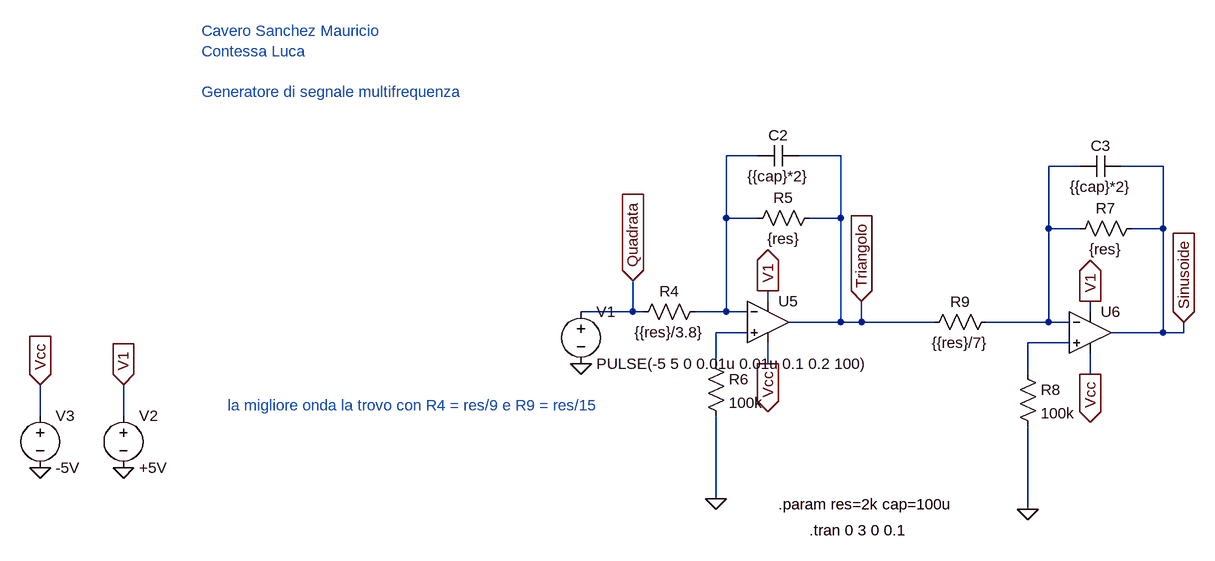
[diagram p0: schematic Progetto_PSE_ideale_v2.asc]
Progetto_PSE_ideale_v2.asc, the LTspice schematic file:
Version 4
SHEET 1 1248 680
WIRE 352 -144 304 -144
WIRE 480 -144 416 -144
WIRE 848 -128 800 -128
WIRE 976 -128 912 -128
WIRE 304 -48 304 -144
WIRE 352 -48 304 -48
WIRE 480 -48 480 -144
WIRE 480 -48 432 -48
WIRE 800 -32 800 -128
WIRE 848 -32 800 -32
WIRE 976 -32 976 -128
WIRE 976 -32 928 -32
WIRE 368 80 368 64
WIRE 160 96 160 48
WIRE 160 96 80 96
WIRE 176 96 160 96
WIRE 304 96 304 -48
WIRE 304 96 256 96
WIRE 336 96 304 96
WIRE 864 96 864 80
WIRE 480 112 480 -48
WIRE 480 112 400 112
WIRE 512 112 512 80
WIRE 512 112 480 112
WIRE 624 112 512 112
WIRE 800 112 800 -32
WIRE 800 112 704 112
WIRE 832 112 800 112
WIRE 336 128 288 128
WIRE 976 128 976 -32
WIRE 976 128 896 128
WIRE 1008 128 1008 112
WIRE 1008 128 976 128
WIRE 832 144 768 144
WIRE 288 176 288 128
WIRE 368 176 368 144
WIRE 768 192 768 144
WIRE 864 192 864 160
WIRE -752 256 -752 208
WIRE -624 256 -624 208
WIRE 288 384 288 256
WIRE 768 400 768 272
FLAG 288 384 0
FLAG 368 64 V1
IOPIN 368 64 Out
FLAG 368 176 Vcc
IOPIN 368 176 Out
FLAG 512 80 Triangolo
IOPIN 512 80 In
FLAG 160 48 Quadrata
IOPIN 160 48 In
FLAG 768 400 0
FLAG 864 80 V1
IOPIN 864 80 Out
FLAG 864 192 Vcc
IOPIN 864 192 Out
FLAG 1008 112 Sinusoide
IOPIN 1008 112 In
FLAG -624 336 0
FLAG -624 208 V1
IOPIN -624 208 In
FLAG -752 336 0
FLAG -752 208 Vcc
IOPIN -752 208 In
FLAG 80 176 0
SYMBOL res 272 80 R90
WINDOW 0 0 56 VBottom 2
WINDOW 3 32 56 VTop 2
SYMATTR InstName R4
SYMATTR Value {{res}/3.8}
SYMBOL res 448 -64 R90
WINDOW 0 0 56 VBottom 2
WINDOW 3 32 56 VTop 2
SYMATTR InstName R5
SYMATTR Value {res}
SYMBOL cap 416 -160 R90
WINDOW 0 0 32 VBottom 2
WINDOW 3 32 32 VTop 2
SYMATTR InstName C2
SYMATTR Value {{cap}*2}
SYMBOL res 272 160 R0
SYMATTR InstName R6
SYMATTR Value 100k
SYMBOL res 944 -48 R90
WINDOW 0 0 56 VBottom 2
WINDOW 3 32 56 VTop 2
SYMATTR InstName R7
SYMATTR Value {res}
SYMBOL cap 912 -144 R90
WINDOW 0 0 32 VBottom 2
WINDOW 3 32 32 VTop 2
SYMATTR InstName C3
SYMATTR Value {{cap}*2}
SYMBOL res 752 176 R0
SYMATTR InstName R8
SYMATTR Value 100k
SYMBOL res 720 96 R90
WINDOW 0 0 56 VBottom 2
WINDOW 3 32 56 VTop 2
SYMATTR InstName R9
SYMATTR Value {{res}/7}
SYMBOL Opamps\\UniversalOpamp2 368 112 R0
SYMATTR InstName U5
SYMBOL Opamps\\UniversalOpamp2 864 128 R0
SYMATTR InstName U6
SYMBOL voltage -624 240 R0
WINDOW 123 0 0 Left 0
WINDOW 39 0 0 Left 0
SYMATTR InstName V2
SYMATTR Value +5V
SYMBOL voltage -752 240 R0
WINDOW 123 0 0 Left 0
WINDOW 39 0 0 Left 0
SYMATTR InstName V3
SYMATTR Value -5V
SYMBOL voltage 80 80 R0
WINDOW 123 0 0 Left 0
WINDOW 39 0 0 Left 0
SYMATTR InstName V1
SYMATTR Value PULSE(-5 5 0 0.01u 0.01u 0.1 0.2 100)
TEXT 432 432 Left 2 !.tran 0 3 0 0.1
TEXT 384 392 Left 2 !.param res=2k cap=100u
TEXT -504 -336 Left 2 ;Cavero Sanchez Mauricio\nContessa Luca\n \nGeneratore di segnale multifrequenza
TEXT -464 240 Left 2 ;la migliore onda la trovo con R4 = res/9 e R9 = res/15

The netlist it stands for:
* Progetto_PSE_ideale_v2.asc
R4 N001 Quadrata {{res}/3.8}
R5 Triangolo N001 {res}
C2 Triangolo N001 {{cap}*2}
R6 N003 0 100k
R7 Sinusoide N002 {res}
C3 Sinusoide N002 {{cap}*2}
R8 N004 0 100k
R9 N002 Triangolo {{res}/7}
XU5 N003 N001 V1 Vcc Triangolo level.2 Avol=1Meg GBW=10Meg Slew=10Meg ilimit=25m rail=0 Vos=0 phimargin=45 en=0 enk=0 in=0 ink=0 Rin=500Meg  ; pins IN+ IN- V+ V- OUT
XU6 N004 N002 V1 Vcc Sinusoide level.2 Avol=1Meg GBW=10Meg Slew=10Meg ilimit=25m rail=0 Vos=0 phimargin=45 en=0 enk=0 in=0 ink=0 Rin=500Meg  ; pins IN+ IN- V+ V- OUT
V2 V1 0 +5V
V3 Vcc 0 -5V
V1 Quadrata 0 PULSE(-5 5 0 0.01u 0.01u 0.1 0.2 100)
.tran 0 3 0 0.1
.param res=2k cap=100u
* Cavero Sanchez Mauricio
* Contessa Luca
* Generatore di segnale multifrequenza
* la migliore onda la trovo con R4 = res/9 e R9 = res/15
.lib UniversalOpamps2.sub
.backanno
.end